# EasyEDA Pro project ProPrj_无线即时通信_2025-03-31.epro, schematic Schematic1
Board Name: 主控板子; Create Date: 2024-08-21; Page Name: P1; Project Name: 无线即时通信; Schematic Name: Schematic1; Update Date: 2025-03-08
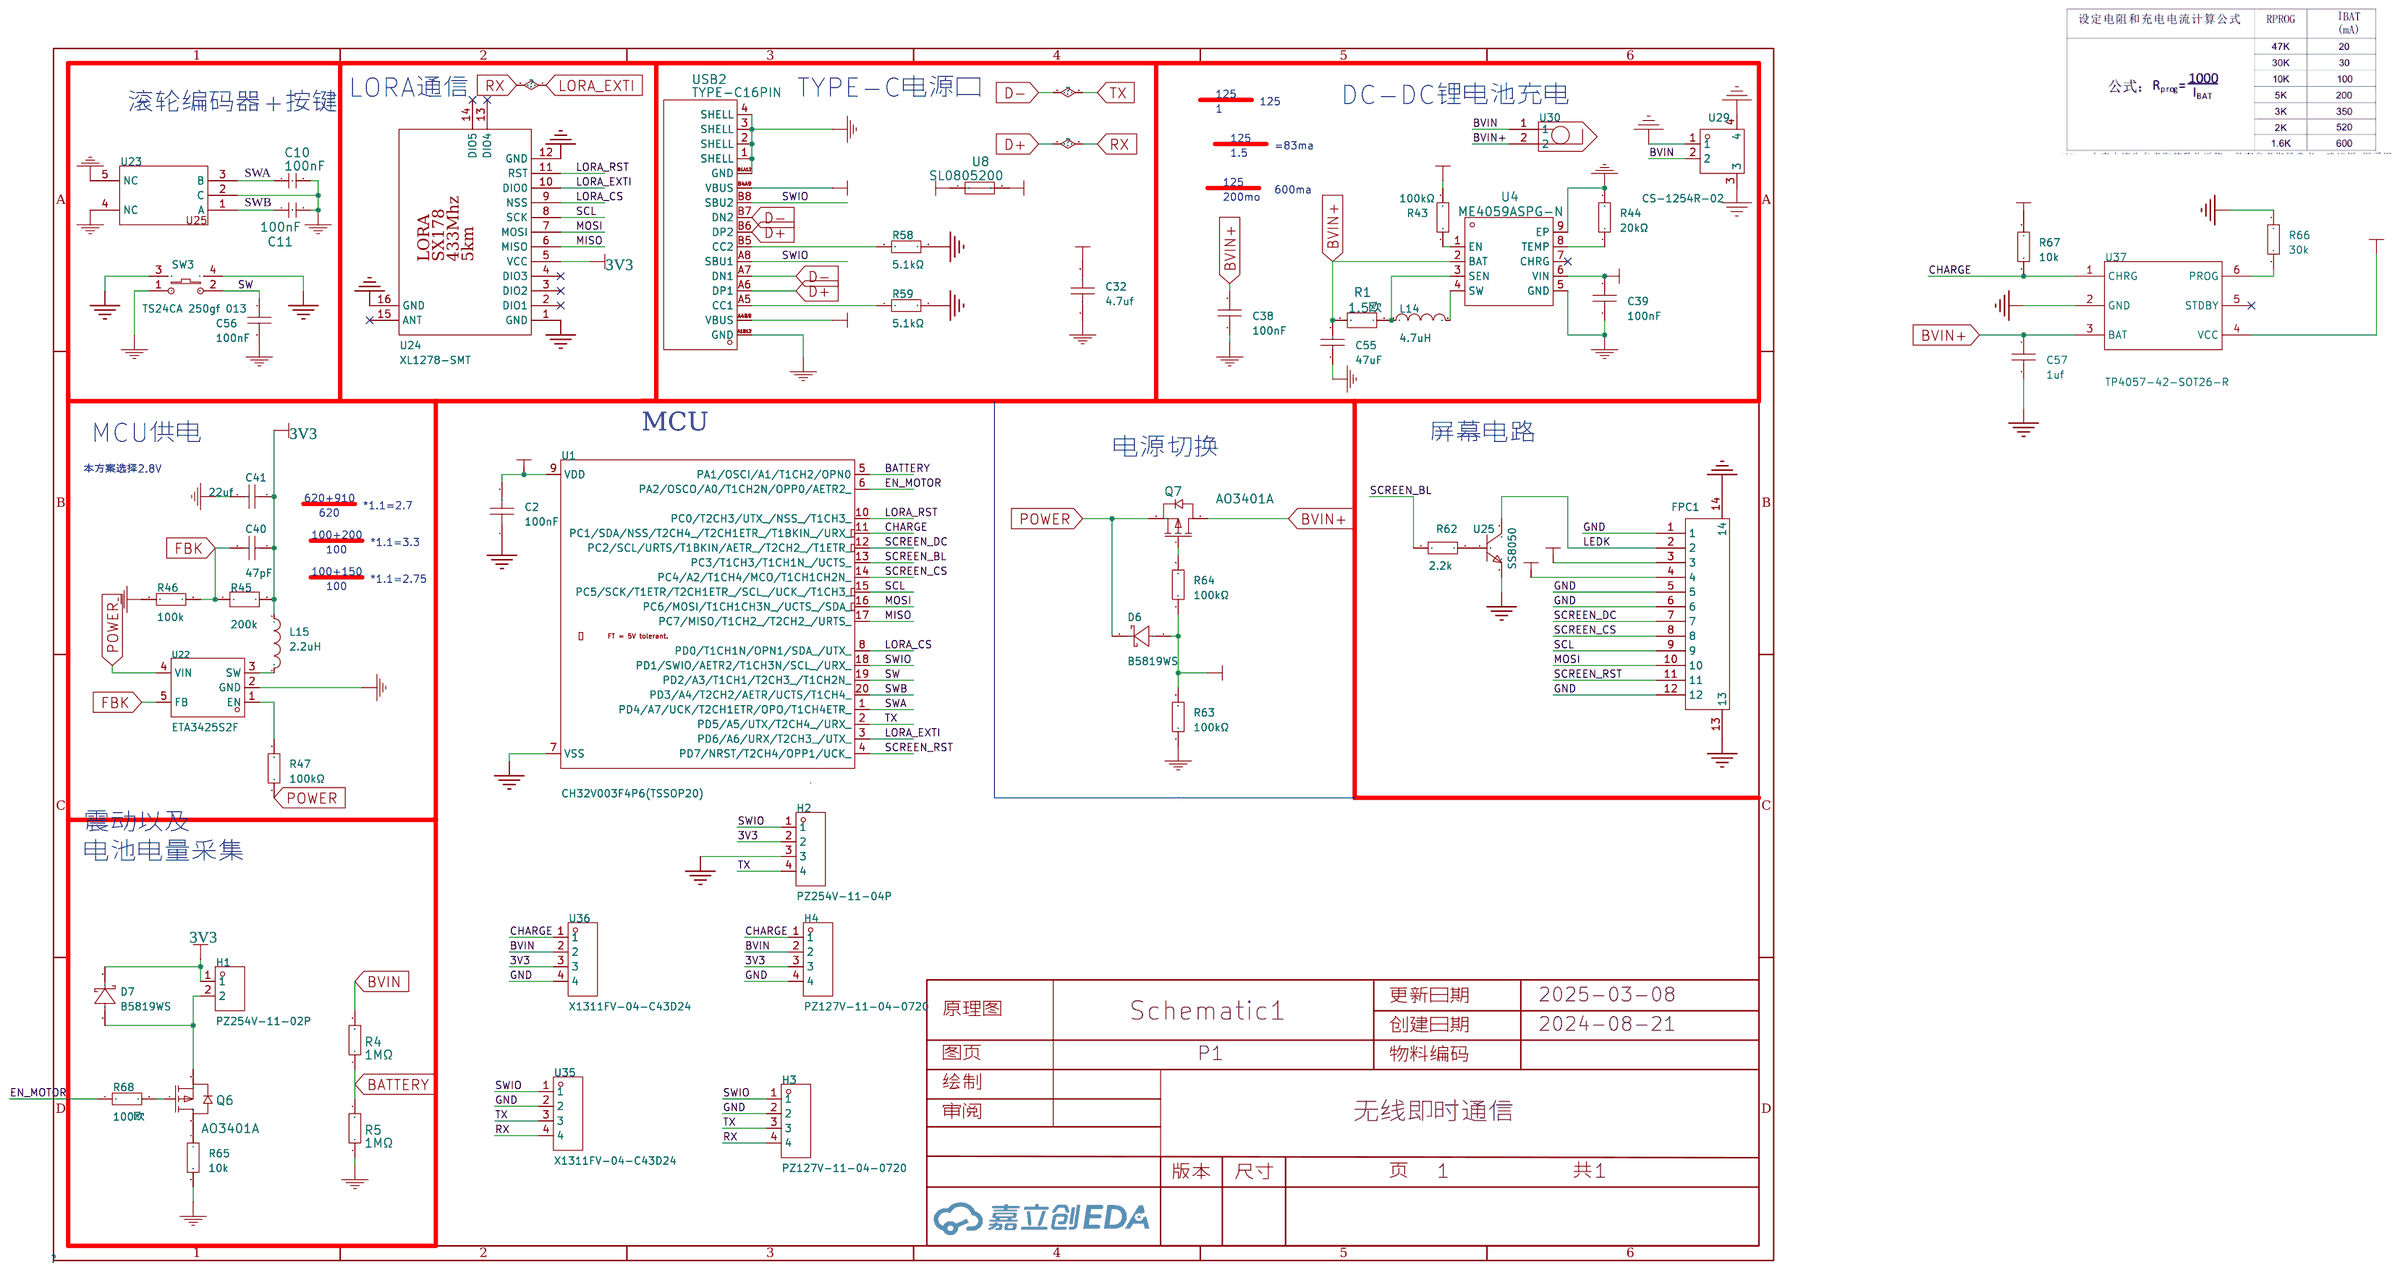
[diagram p1: schematic sheet]

## Parts
C2  100nF  [C0603]
C10  100nF  [C0603]
C11  100nF  [C0603]
C32  4.7uf  [C0603]
C38  100nF  [C0603]
C39  100nF  [C0603]
C40  47pF  [C0603]
C41  22uf  [C0603]
C55  47uF  [C0603]
C56  100nF  [C0603]
C57  1uf  [C0603]
D6  B5819WS  [SOD-323F_L1.7-W1.3-LS2.5-R-RD-1]
D7  B5819WS  [SOD-323F_L1.7-W1.3-LS2.5-R-RD-1]
FPC1  AFH34-S12FIA-1H  [FPC-SMD_12P-P0.50_THD0509-12CL-GF]
H1  PZ254V-11-02P  [HDR-TH_2P-P2.54-V-M]
H2  PZ254V-11-04P  [HDR-TH_4P-P2.54-V-M]
H3  PZ127V-11-04-0720  [HDR-TH_4P-P1.27-V-M]
H4  PZ127V-11-04-0720  [HDR-TH_4P-P1.27-V-M]
L14  4.7uH  [L0603]
L15  2.2uH  [L0603]
Q6  AO3401A  [SOT-23_L2.9-W1.3-P0.95-LS2.4-BR]
Q7  AO3401A  [SOT-23_L2.9-W1.3-P0.95-LS2.4-BR]
R1  1.5欧  [R0603]
R4  1MΩ  [R0603]
R5  1MΩ  [R0603]
R43  100kΩ  [R0603]
R44  20kΩ  [R0603]
R45  200k  [R0603]
R46  100k  [R0603]
R47  100kΩ  [R0603]
R58  5.1kΩ  [R0603]
R59  5.1kΩ  [R0603]
R62  2.2k  [R0603]
R63  100kΩ  [R0603]
R64  100kΩ  [R0603]
R65  10k  [R0603]
R66  30k  [R0603]
R67  10k  [R0603]
R68  100欧  [R0603]
SW3  TS24CA 250gf 013  [SW-SMD_L4.7-W3.5-P3.35-EH]
U1  CH32V003F4P6(TSSOP20)  [OLIMEX_IC-FP:TSSOP20_Pitch-0.65mm_6.6x4.5x1.2mm]
U4  ME4059ASPG-N  [ESOP-8_L4.9-W3.9-P1.27-LS6.0-BL-EP]
U8  SL0805200  [F0805]
U22  ETA3425S2F  [SOT-23-5_L2.9-W1.6-P0.95-LS2.8-BL]
U23  -  [e5e8]
U24  XL1278-SMT  [SX1278]
U25  SS8050  [SOT-23-3_L2.9-W1.3-P1.90-LS2.4-BR]
U29  CS-1254R-02  [CONN-SMD_2P-P1.00_CS-1254R-02]
U30  -  [水银开关]
U35  X1311FV-04-C43D24  [HDR-TH_4P-P1.27-V-F]
U36  X1311FV-04-C43D24  [HDR-TH_4P-P1.27-V-F]
U37  TP4057-42-SOT26-R  [SOT-23-6_L2.9-W1.6-P0.95-LS2.8-BL]
USB2  TYPE-C16PIN  [USB-C-SMD_TYPE-C16PIN]

## Library data of the parts
C2 = CC0603KPX7R7BB104: 容值:100nF;精度:±10%;额定电压:16V;材质(温度系数):X7R;; LCSC Part Name: 100nF ±10% 16V; Supplier Part: C2649559; Manufacturer: YAGEO(国巨); Supplier Footprint: 0603; JLCPCB Part Class: 扩展库; Datasheet: https://atta.szlcsc.com/upload/public/pdf/source/20211006/C2649559_3EFA7FBD73408E19E0F5D8CD608EC585.pdf; Supplier: LCSC; Tolerance: ±10%; Voltage Rated: 16V; Temperature Coefficient: X7R
C10 C11 = C0603C104K3RACAUTO: Supplier: LCSC; Supplier Part: C172738; Manufacturer: KEMET
C32 = CL10A226MP8NUNE: 容值:22uF;精度:±20%;额定电压:10V;材质(温度系数):X5R;; LCSC Part Name: 22uF ±20% 10V; Supplier Part: C86295; Manufacturer: SAMSUNG(三星); Supplier Footprint: 0603; JLCPCB Part Class: 扩展库; Datasheet: https://atta.szlcsc.com/upload/public/pdf/source/20160218/1457707763339.pdf; Supplier: LCSC; Tolerance: ±20%; Voltage Rated: 10V; Temperature Coefficient: X5R
C38 C39 C41 C56 C57 = 0603B104K500NT: 容值:100nF;精度:±10%;额定电压:50V;材质(温度系数):X7R;; LCSC Part Name: 100nF ±10% 50V; Supplier Part: C30926; Manufacturer: FH(风华); Supplier Footprint: 0603; JLCPCB Part Class: 扩展库; Datasheet: https://atta.szlcsc.com/upload/public/pdf/source/20200305/C486355_26A10D38EF8C2A5C37091D0039909270.pdf; Supplier: LCSC; Tolerance: ±10%; Voltage Rated: 50V; Temperature Coefficient: X7R
C40 = CL10C470JB8NNNC: 容值:47pF;精度:±5%;额定电压:50V;材质(温度系数):C0G;; LCSC Part Name: 47pF ±5% 50V; Supplier Part: C1671; Manufacturer: SAMSUNG(三星); Supplier Footprint: 0603; JLCPCB Part Class: Basic Part; Datasheet: https://atta.szlcsc.com/upload/public/pdf/source/20160218/1457707763339.pdf; Supplier: LCSC; Tolerance: ±5%; Voltage Rated: 50V; Temperature Coefficient: C0G
C55 = GRM188R60J476ME15D: 容值:47uF;精度:±20%;额定电压:6.3V;材质(温度系数):X5R;; LCSC Part Name: 47uF ±20% 6.3V; Supplier Part: C140782; Manufacturer: muRata(村田); Supplier Footprint: 0603; JLCPCB Part Class: 扩展库; Datasheet: https://atta.szlcsc.com/upload/public/pdf/source/20171113/C140782_15105612981581115778.pdf; Supplier: LCSC; Tolerance: ±20%; Voltage Rated: 6.3V; Temperature Coefficient: X5R
D6 D7 = B5819WS_C6067464: 二极管配置:独立式;正向压降(Vf):550mV@1A;直流反向耐压(Vr):40V;整流电流:1A;; Supplier Part: C6067464; Manufacturer: GOODWORK(固得沃克); Supplier Footprint: SOD-323; JLCPCB Part Class: 扩展库; Datasheet: https://atta.szlcsc.com/upload/public/pdf/source/20240805/1B3D814487F6271BE6139AA96BABBD15.pdf; Supplier: LCSC; Diode Configuration: 独立式; Forward Voltage (Vf@If): 550mV@1A; Reverse Voltage (Vr): 40V; Rectified Current: 1A; Reverse Leakage Current (Ir): 50uA
FPC1 = AFH34-S12FIA-1H: 锁定特性:翻盖式;触点类型:双侧触点/上下接;触点数量:12P;间距:0.5mm;安装类型:卧贴;; Supplier Part: C5139824; Manufacturer: JS(钜硕电子); Supplier Footprint: SMD,P=0.5mm; JLCPCB Part Class: Extended Part; Datasheet: https://atta.szlcsc.com/upload/public/pdf/source/20220815/7D7DE7AF64D38F9F159F8B104D5F304C.pdf; Supplier: LCSC; Locking Feature: 翻盖式; Contact Type: 双侧触点/上下接; Number of Contacts: 12P; Pitch: 0.5mm; Mounting Type: 卧贴; Height Above Board: 1mm; Contact Plating: 金; FFC, FCB Thickness: 0.3mm
H1 = PZ254V-11-02P: 插针结构:1x2P;间距:2.54mm;行距:-;圆针/方针:方针;安装类型:直插;排数:单排;总PIN位数:2P;额定电流:-;额定电压:-;配合针长度:6mm;塑高:2.5mm;端接针长度:3mm;触头材质:黄铜;触头镀层:-;工作温度范围:-40℃~+105℃;颜色:黑色;; LCSC Part Name: 间距:2.54mm 1x2P 直插 方针; Supplier Part: C492401; Manufacturer: XFCN(兴飞); Supplier Footprint: 插件,P=2.54mm; JLCPCB Part Class: 扩展库; Datasheet: https://atta.szlcsc.com/upload/public/pdf/source/20200309/C492401_A812433581A9B211A7FFA413ADDFF0E5.pdf; Supplier: LCSC; Pin Structure: 1x2P; Pitch: 2.54mm; Circluar Pins/Square Pins: 方针; Mounting Type: 直插; Number of Rows: 单排; Number of Pins: 2P; Length of Mating Pin: 6mm; Insulation Height: 2.5mm; Length of End Connection Pin: 3mm; Contact Material: 黄铜; Operating Temperature Range: -40℃~+105℃; Color: 黑色
H2 = PZ254V-11-04P: 插针结构:1x4P;间距:2.54mm;行距:-;圆针/方针:方针;安装类型:直插;排数:单排;总PIN位数:4P;额定电流:3A;额定电压:250V;配合针长度:6mm;塑高:2.5mm;端接针长度:3mm;触头材质:-;工作温度范围:-40℃~+105℃;颜色:黑色;; LCSC Part Name: 间距:2.54mm 1x4P 直插 方针; Supplier Part: C2691448; Manufacturer: XFCN(兴飞); Supplier Footprint: 插件,P=2.54mm; JLCPCB Part Class: 扩展库; Datasheet: https://atta.szlcsc.com/upload/public/pdf/source/20200309/C492403_F9F19131791D08044AD4F84F8E751A34.pdf; Supplier: LCSC; Pin Structure: 1x4P; Pitch: 2.54mm; Circluar Pins/Square Pins: 方针; Mounting Type: 直插; Number of Rows: 单排; Number of Pins: 4P; Current Rating (Max): 3A; Voltage Rating (Max): 250V; Length of Mating Pin: 6mm; Insulation Height: 2.5mm; Length of End Connection Pin: 3mm; Operating Temperature Range: -40℃~+105℃; Color: 黑色
H3 H4 = PZ127V-11-04-0720: 插针结构:1x4P;间距:1.27mm;行距:-;圆针/方针:-;安装类型:直插;排数:单排;总PIN位数:4P;额定电流:-;额定电压:-;配合针长度:3.9mm;塑高:1mm;端接针长度:2.3mm;触头材质:黄铜;触头镀层:-;工作温度范围:-40℃~+105℃;焊接温度(最大值):-;颜色:黑色;; LCSC Part Name: 间距:1.27mm 1x4P 直插; Supplier Part: C541879; Manufacturer: XFCN(兴飞); Supplier Footprint: 插件,P=1.27mm; JLCPCB Part Class: 扩展库; Datasheet: https://atta.szlcsc.com/upload/public/pdf/source/20200519/C541879_5CD99C402ABEE613587AE88FBA356357.pdf; Supplier: LCSC; Pin Structure: 1x4P; Pitch: 1.27mm; Mounting Type: 直插; Number of Rows: 单排; Number of Pins: 4P; Length of Mating Pin: 3.9mm; Insulation Height: 1mm; Length of End Connection Pin: 2.3mm; Contact Material: 黄铜; Operating Temperature Range: -40℃~+105℃; Color: 黑色
L14 = CMH160808B4R7MT: 电感值:4.7uH;精度:±20%;额定电流:700mA;; LCSC Part Name: 4.7uH ±20%; Supplier Part: C394952; Manufacturer: FH(风华); Supplier Footprint: 0603; JLCPCB Part Class: 扩展库; Datasheet: https://atta.szlcsc.com/upload/public/pdf/source/20230223/142B566F7A79878A07A1E031813F1064.pdf; Supplier: LCSC; Tolerance: ±20%; Rated Current: 700mA; DC Resistance (DCR): 500mΩ; Ratings: AEC-Q200
L15 = CMH160808B2R2MT: 电感值:2.2uH;精度:±20%;额定电流:750mA;; LCSC Part Name: 2.2uH ±20%; Supplier Part: C394950; Manufacturer: FH(风华); Supplier Footprint: 0603; JLCPCB Part Class: 扩展库; Datasheet: https://atta.szlcsc.com/upload/public/pdf/source/20230223/142B566F7A79878A07A1E031813F1064.pdf; Supplier: LCSC; Tolerance: ±20%; Rated Current: 750mA; DC Resistance (DCR): 240mΩ; Ratings: AEC-Q200
Q6 Q7 = AO3401A: Supplier: LCSC; Supplier Part: C347476; Manufacturer: Youtai Semiconductor Co., Ltd.
R1 = 0603WAF200LT5E: 电阻类型:厚膜电阻;阻值:200mΩ;精度:±1%;功率:100mW;最大工作电压:75V;温度系数:±800ppm/℃;; LCSC Part Name: 200mΩ ±1% 100mW 厚膜电阻; Supplier Part: C79773; Manufacturer: UNI-ROYAL(厚声); Supplier Footprint: 0603; JLCPCB Part Class: Extended Part; Datasheet: https://atta.szlcsc.com/upload/public/pdf/source/20200306/C422600_1E6D84923E4A46A82E41ADD87F860B5C.pdf; Supplier: LCSC; Type: 厚膜电阻; Tolerance: ±1%; Power(Watts): 100mW; Overload Voltage (Max): 75V; Temperature Coefficient: ±800ppm/℃; Operating Temperature Range: -55℃~+155℃
R4 R5 = 0603WAF1003T5E: 电阻类型:厚膜电阻;阻值:100kΩ;精度:±1%;功率:100mW;最大工作电压:75V;温度系数:±100ppm/℃;; LCSC Part Name: 100kΩ ±1% 100mW 厚膜电阻; Supplier Part: C25803; Manufacturer: UNI-ROYAL(厚声); Supplier Footprint: 0603; JLCPCB Part Class: Basic Part; Datasheet: https://atta.szlcsc.com/upload/public/pdf/source/20200306/C422600_1E6D84923E4A46A82E41ADD87F860B5C.pdf; Supplier: LCSC; Type: 厚膜电阻; Tolerance: ±1%; Power(Watts): 100mW; Overload Voltage (Max): 75V; Temperature Coefficient: ±100ppm/℃; Operating Temperature Range: -55℃~+155℃; Resistance: 220kΩ
R43 R47 = RC0603FR-07100KL: 电阻类型:厚膜电阻;阻值:100kΩ;精度:±1%;功率:100mW;最大工作电压:75V;温度系数:±100ppm/℃;; LCSC Part Name: 厚膜电阻 100kΩ ±1% 100mW; Supplier Part: C14675; Manufacturer: YAGEO(国巨); Supplier Footprint: 0603; JLCPCB Part Class: Extended Part; Datasheet: https://atta.szlcsc.com/upload/public/pdf/source/20140324/1457707028752.pdf; Supplier: LCSC; Type: 厚膜电阻; Tolerance: ±1%; Power(Watts): 100mW; Overload Voltage (Max): 75V; Temperature Coefficient: ±100ppm/℃; Operating Temperature Range: -55℃~+155℃
R44 R65-R68 = 0603WAF2002T5E: 电阻类型:厚膜电阻;阻值:20kΩ;精度:±1%;功率:100mW;最大工作电压:75V;温度系数:±100ppm/℃;; LCSC Part Name: 20kΩ ±1% 100mW 厚膜电阻; Supplier Part: C4184; Manufacturer: UNI-ROYAL(厚声); Supplier Footprint: 0603; JLCPCB Part Class: 基础库; Datasheet: https://atta.szlcsc.com/upload/public/pdf/source/20200306/C422600_1E6D84923E4A46A82E41ADD87F860B5C.pdf; Supplier: LCSC; Type: 厚膜电阻; Tolerance: ±1%; Power(Watts): 100mW; Overload Voltage (Max): 75V; Temperature Coefficient: ±100ppm/℃; Operating Temperature Range: -55℃~+155℃
R45 = FRC0603F9103TS: 电阻类型:厚膜电阻;阻值:910kΩ;精度:±1%;功率:100mW;最大工作电压:75V;温度系数:±100ppm/℃;; LCSC Part Name: 910kΩ ±1% 100mW 厚膜电阻; Supplier Part: C2907075; Manufacturer: FOJAN(富捷); Supplier Footprint: 0603; JLCPCB Part Class: 扩展库; Datasheet: https://atta.szlcsc.com/upload/public/pdf/source/20211221/925EC7D7225764EE0046F22065062C87.pdf; Supplier: LCSC; Type: 厚膜电阻; Tolerance: ±1%; Power(Watts): 100mW; Overload Voltage (Max): 75V; Temperature Coefficient: ±100ppm/℃; Operating Temperature Range: -55℃~+155℃
R46 = 0603WAF6203T5E: 电阻类型:厚膜电阻;阻值:620kΩ;精度:±1%;功率:100mW;最大工作电压:75V;温度系数:±100ppm/℃;; LCSC Part Name: 620kΩ ±1% 100mW 厚膜电阻; Supplier Part: C23219; Manufacturer: UNI-ROYAL(厚声); Supplier Footprint: 0603; JLCPCB Part Class: 扩展库; Datasheet: https://atta.szlcsc.com/upload/public/pdf/source/20200306/C422600_1E6D84923E4A46A82E41ADD87F860B5C.pdf; Supplier: LCSC; Type: 厚膜电阻; Tolerance: ±1%; Power(Watts): 100mW; Overload Voltage (Max): 75V; Temperature Coefficient: ±100ppm/℃; Operating Temperature Range: -55℃~+155℃
R58 R59 = 0603WAF5101T5E: 电阻类型:厚膜电阻;阻值:5.1kΩ;精度:±1%;功率:100mW;最大工作电压:75V;温度系数:±100ppm/℃;; LCSC Part Name: 5.1kΩ ±1% 100mW 厚膜电阻; Supplier Part: C23186; Manufacturer: UNI-ROYAL(厚声); Supplier Footprint: 0603; JLCPCB Part Class: 基础库; Datasheet: https://atta.szlcsc.com/upload/public/pdf/source/20200306/C422600_1E6D84923E4A46A82E41ADD87F860B5C.pdf; Supplier: LCSC; Type: 厚膜电阻; Tolerance: ±1%; Power(Watts): 100mW; Overload Voltage (Max): 75V; Temperature Coefficient: ±100ppm/℃; Operating Temperature Range: -55℃~+155℃
R62 = Res_0603: Supplier Footprint: 0603
R63 R64 = 0603WAF1003T5E: 电阻类型:厚膜电阻;阻值:100kΩ;精度:±1%;功率:100mW;最大工作电压:75V;温度系数:±100ppm/℃;; LCSC Part Name: 100kΩ ±1% 100mW 厚膜电阻; Supplier Part: C25803; Manufacturer: UNI-ROYAL(厚声); Supplier Footprint: 0603; JLCPCB Part Class: Basic Part; Datasheet: https://atta.szlcsc.com/upload/public/pdf/source/20200306/C422600_1E6D84923E4A46A82E41ADD87F860B5C.pdf; Supplier: LCSC; Type: 厚膜电阻; Tolerance: ±1%; Power(Watts): 100mW; Overload Voltage (Max): 75V; Temperature Coefficient: ±100ppm/℃; Operating Temperature Range: -55℃~+155℃
SW3 = TS24CA 250gf 013: 电路结构:单刀单掷;按钮形状:矩形按钮;作用力:250gf;安装方式:卧贴;开关长度:4.55mm;开关宽度:1.8mm;开关高度:3.5mm;带支架:不带;触点电流:50mA;额定电压(AC):-;额定电压(DC):12V;额定功率:0.6W;绝缘电阻:100MΩ;带灯:无;机械寿命:3万次;; LCSC Part Name: 2*4*3.5mm半包小贝贝TS-018小侧按键m165蓝牙耳机开关 250gf; Supplier Part: C5373430; Manufacturer: SHOU HAN(首韩); Supplier Footprint: SMD; JLCPCB Part Class: 扩展库; Datasheet: https://atta.szlcsc.com/upload/public/pdf/source/20230321/913029B0FB0CD391AF5EFD51697D8EC4.pdf; Supplier: LCSC; Circuit: 单刀单掷; Actuator Style: 矩形按钮; Operating Force: 250gf; Mounting Style: 卧贴; Switch Length: 4.55mm; Switch Width: 1.8mm; Switch Height: 3.5mm; Strike Gundam: 不带; Contact Current: 50mA; Voltage Rating (DC): 12V; Power Rating: 0.6W; Insulation Resistance: 100MΩ; Actuator/Cap Color: 黑色; With Lamp: 无; Mechanical Life: 3万次; Operating Temperature: -40℃~+85℃
U1 = CH32V003F4P6(TSSOP20): User doc link: http://www.wch-ic.com/downloads/CH32V003DS0_PDF.html
U4 = ME4059ASPG-N: Supplier: LCSC; Supplier Part: C427588; Manufacturer: Nanjing Micro One Elec
U8 = SL0805200: 最大电压:6V;最大电流:50A;保持电流:2A;跳闸电流:4A;; LCSC Part Name: 6V 2A 0805自恢复; Supplier Part: C70158; Manufacturer: 台湾陆海; Supplier Footprint: 0805; JLCPCB Part Class: Extended Part; Datasheet: https://atta.szlcsc.com/upload/public/pdf/source/20160823/1471947506254.pdf; Supplier: LCSC; Operating Voltage (Max): 6V; Current Rating (Max): 50A; Hold Current: 2A; Trip Current: 4A; Power Dissipation: 1W; Resistance - Initial (Ri) (Min): 8mΩ; Resistance - Post Trip (R1) (Max): 55mΩ; Maximum Time to Trip: 5s; Operating Temperature: -40℃~+70℃
U22 = ETA3425S2F_C7465503: Supplier Part: C7465503; Manufacturer: ETA(钰泰）; Supplier Footprint: SOT23-5; JLCPCB Part Class: 扩展库; Datasheet: https://atta.szlcsc.com/upload/public/pdf/source/20230717/4FEEC72C84A7B303B210F98BCAAF2B0F.pdf; Supplier: LCSC
U23 = e5e8
U24 = XL1278-SMT
U25 = SS8050_C7420370: 晶体管类型:NPN;集电极电流(Ic):1.5A;集射极击穿电压(Vceo):25V;功率(Pd):300mW;直流电流增益(hFE@Ic,Vce):120@100mA,1.0V;; LCSC Part Name: 耐压:25V 电流:1.5A NPN H档 200-350; Supplier Part: C7420370; Manufacturer: 宏迦橙; Supplier Footprint: SOT-23; JLCPCB Part Class: 扩展库; Datasheet: https://atta.szlcsc.com/upload/public/pdf/source/20231222/9C4050A7669EB24B3ACD0418218817FD.pdf; Supplier: LCSC; Transistor Type: NPN; Collector Current (Ic): 1.5A; Collector-Emitter Breakdown Voltage (Vceo): 25V; Power Dissipation (Pd): 300mW; DC Current Gain (hFE@Ic,Vce): 120@100mA,1.0V; Transition Frequency (fT): 100MHz; Collector Cut-Off Current (Icbo): 100nA; Collector-Emitter Saturation Voltage (VCE(sat)@Ic,Ib): 500mV@800mA,80mA; Operating Temperature: -55℃~+150℃
U29 = CS-1254R-02: LCSC Part Name: SH1.0 2P针座 卧式贴片; Supplier Part: C5142894; Manufacturer: CST(永丰盈); Supplier Footprint: SMD,P=1mm; JLCPCB Part Class: 扩展库; Datasheet: https://atta.szlcsc.com/upload/public/pdf/source/20220830/B3A20729863F2D40D207DAE143922DD6.pdf; Supplier: LCSC
U30 = 水银开关: _: 3
U35 U36 = X1311FV-04-C43D24: 插孔结构:1x4P;间距:1.27mm;行距:-;圆孔/方孔:方孔;安装类型:直插;排数:单排;总孔位数:4P;额定电流:1A;额定电压:250V;插孔方向:顶部;塑高:4.3mm;触头材质:黄铜;触头镀层:金;工作温度范围:-40℃~+105℃;焊接温度(最大值):260℃;; LCSC Part Name: 间距:1.27mm 1x4P 直插; Supplier Part: C2881436; Manufacturer: XKB Connection(中国星坤); Supplier Footprint: 插件,P=1.27mm; JLCPCB Part Class: Extended Part; Datasheet: https://atta.szlcsc.com/upload/public/pdf/source/20211011/F526630552BB71E765C33B5DAF387600.pdf; Supplier: LCSC; Holes Structure: 1x4P; Pitch: 1.27mm; Circular Hole / Square Hole: 方孔; Mounting Type: 直插; Number of Rows: 单排; Number of Holes: 4P; Current Rating (Max): 1A; Voltage Rating (Max): 250V; Holes Direction: 顶部; Insulation Height: 4.3mm; Contact Material: 黄铜; Contact Plating: 金; Operating Temperature Range: -40℃~+105℃; Soldering Temperature(Max): 260℃
U37 = TP4057-42-SOT26-R: LCSC Part Name: TP4057 1%; Supplier Part: C12044; Manufacturer: TOPPOWER(南京拓微); Supplier Footprint: SOT-23-6; JLCPCB Part Class: 扩展库; Datasheet: https://atta.szlcsc.com/upload/public/pdf/source/20140228/1457706997013.pdf; Supplier: LCSC
USB2 = TYPE-C16PIN: Supplier: LCSC; Supplier Part: C393939; Manufacturer: SHOU HAN

## Nets
3V3: C2.2 C40.2 C41.1 D7.2(K) FPC1.3 FPC1.4 H1.1 H2.2 H4.3 L15.1 R45.2 R67.1 U1.9(VDD) U24.5(VCC) U36.3
GND: C2.1 C10.2 C11.2 C32.1 C38.1 C39.1 C41.2 C55.1 C56.2 C57.1 FPC1.1 FPC1.5 FPC1.6 FPC1.12 FPC1.13 FPC1.14 H2.3 H3.2 H4.4 R5.1 R44.2 R46.1 R58.2 R59.2 R63.1 R65.2 R66.1 SW3.1 SW3.3 SW3.4 U1.7(VSS) U4.5(GND) U4.9(EP) U22.2(GND) U23.2(C) U23.4(NC) U23.5(NC) U24.1(GND) U24.12(GND) U24.16(GND) U25.2(E) U29.1 U29.3 U29.4 U35.2 U36.4 U37.2(GND) USB2.1(SHELL) USB2.2(SHELL) USB2.3(SHELL) USB2.4(SHELL) USB2.A1B12(GND) USB2.B1A12(GND)
VIN: C32.2 C39.2 D6.1(A) R43.2 R63.2 R64.1 U4.6(VIN) U8.2 U37.4(VCC)
VIN1: U8.1 USB2.A4B9(VBUS) USB2.B4A9(VBUS)
BATTERY: R4.1 R5.2 U1.5(PA1/OSCI/A1/T1CH2/OPN0)
BVIN: H4.2 R4.2 U29.2 U30.1 U36.2
BVIN+: C38.2 C55.2 C57.2 Q7.3(D) R1.1 U4.2(BAT) U30.2 U37.3(BAT)
CHARGE: H4.1 R67.2 U1.11(PC1/SDA/NSS/T2CH4_/T2CH1ETR_/T1BKIN_/URX_) U36.1 U37.1(CHRG)
D+: H3.4 U1.3(PD6/A6/URX/T2CH3_/UTX_) U24.10(DIO0) U35.4 USB2.A6(DP1) USB2.B6(DP2)
D-: H2.4 H3.3 U1.2(PD5/A5/UTX/T2CH4_/URX_) U35.3 USB2.A7(DN1) USB2.B7(DN2)
EN_MOTOR: R68.1 U1.6(PA2/OSCO/A0/T1CH2N/OPP0/AETR2_)
FBK: C40.1 R45.1 R46.2 U22.5(FB)
LEDK: FPC1.2 U25.3(C)
LORA_CS: U1.8(PD0/T1CH1N/OPN1/SDA_/UTX_) U24.9(NSS)
LORA_RST: U1.10(PC0/T2CH3/UTX_/NSS_/T1CH3_) U24.11(RST)
MISO: U1.17(PC7/MISO/T1CH2_/T2CH2_/URTS_) U24.6(MISO)
MOSI: FPC1.10 U1.16(PC6/MOSI/T1CH1CH3N_/UCTS_/SDA_) U24.7(MOSI)
POWER: D6.2(K) Q7.2(S) R47.1 U22.4(VIN)
SCL: FPC1.9 U1.15(PC5/SCK/T1ETR/T2CH1ETR_/SCL_/UCK_/T1CH3_) U24.8(SCK)
SCREEN_BL: R62.1 U1.13(PC3/T1CH3/T1CH1N_/UCTS_)
SCREEN_CS: FPC1.8 U1.14(PC4/A2/T1CH4/MCO/T1CH1CH2N_)
SCREEN_DC: FPC1.7 U1.12(PC2/SCL/URTS/T1BKIN/AETR_/T2CH2_/T1ETR_)
SCREEN_RST: FPC1.11 U1.4(PD7/NRST/T2CH4/OPP1/UCK_)
SW: C56.1 SW3.2 U1.19(PD2/A3/T1CH1/T2CH3_/T1CH2N_)
SWA: C10.1 U1.1(PD4/A7/UCK/T2CH1ETR/OPO/T1CH4ETR_) U23.3(B)
SWB: C11.1 U1.20(PD3/A4/T2CH2/AETR/UCTS/T1CH4_) U23.1(A)
SWIO: H2.1 H3.1 U1.18(PD1/SWIO/AETR2/T1CH3N/SCL_/URX_) U35.1 USB2.A8(SBU1) USB2.B8(SBU2)
$1N1346: D7.1(A) H1.2 Q6.2(S)
$1N2494: R47.2 U22.1(EN)
$1N2496: L15.2 U22.3(SW)
$1N3170: R59.1 USB2.A5(CC1)
$1N3180: R58.1 USB2.B5(CC2)
$1N4201: R62.2 U25.1(B)
$1N45129: Q7.1(G) R64.2
$1N45683: R66.2 U37.6(PROG)
$1N45972: Q6.3(D) R65.1
$1N46012: Q6.1(G) R68.2
Net-(L14-1): L14.1 R1.2 U4.3(SEN)
Net-(L14-2): L14.2 U4.4(SW)
Net-(R43-1): R43.1 U4.1(EN)
Net-(R44-1): R44.1 U4.8(TEMP)

Not connected (* = marked no-connect by the designer): U4 7(CHRG)*; U24 2(DIO1)* 3(DIO2)* 4(DIO3)* 13(DIO4)* 14(DIO5)* 15(ANT)*; U37 5(STDBY)*

## Notes on the sheet
- LORA通信
- TYPE-C电源口
- 125
- 125
- DC-DC锂电池充电
- 滚轮编码器+按键
- 1
- 125
- 1.5
- =83ma
- 125
- 600ma
- 200mo
- MCU
- MCU供电
- 屏幕电路
- 电源切换
- 本方案选择2.8V
- 620+910
- 620
- *1.1=2.7
- 100+200
- 100
- *1.1=3.3
- 100+150
- 100
- *1.1=2.75
- 震动以及
  电池电量采集
